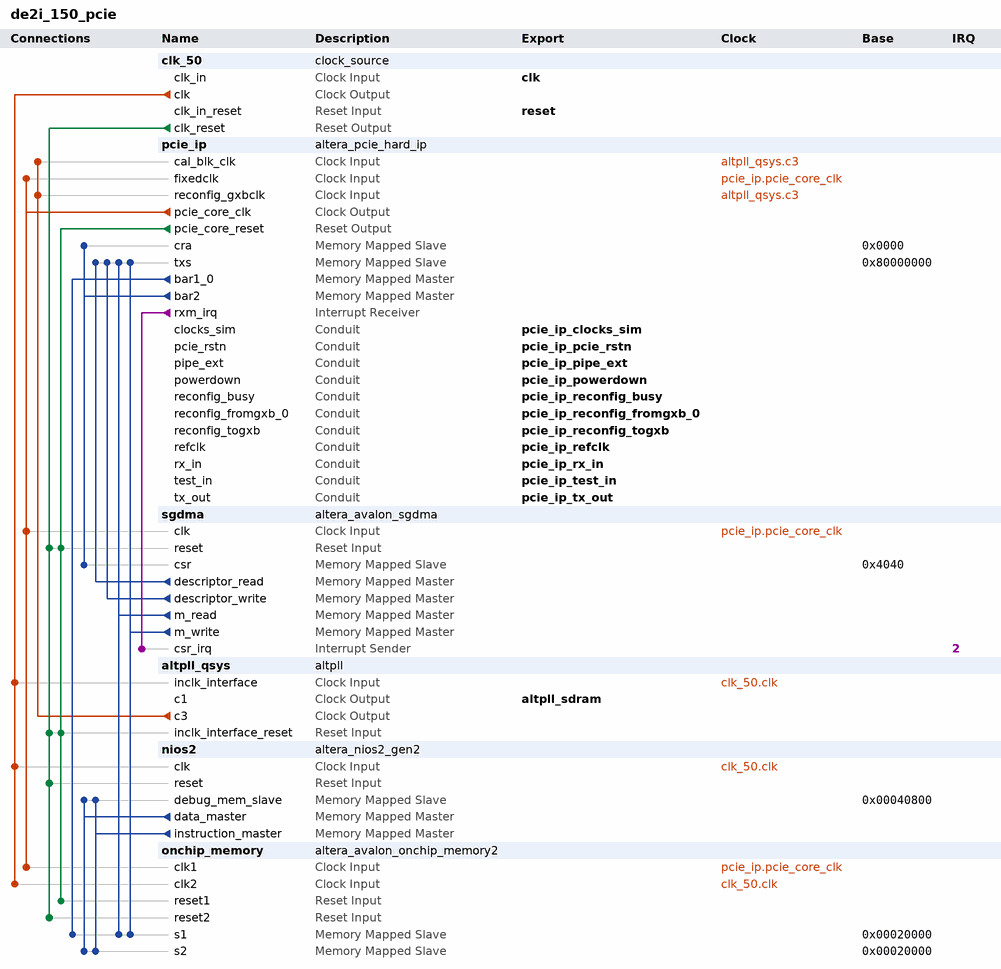
[diagram p0: system contents]
# Platform Designer (Qsys) system de2i_150_pcie, Cyclone IV GX EP4CGX150DF31C7
# Parameters at their usual value, and those the tool derives, are not listed.
package require -exact qsys 15.1
create_system de2i_150_pcie
set_project_property DEVICE_FAMILY {Cyclone IV GX}
set_project_property DEVICE EP4CGX150DF31C7

add_instance clk_50 clock_source 15.1
set_instance_parameter_value clk_50 clockFrequency 50000000

add_instance pcie_ip altera_pcie_hard_ip 15.1
set_instance_parameter_value pcie_ip {BAR Type} {64 bit Prefetchable,Not used,32 bit Non-Prefetchable,Not used,Not used,Not used}
set_instance_parameter_value pcie_ip CB_A2P_ADDR_MAP_PASS_THRU_BITS 31
set_instance_parameter_value pcie_ip CG_ENABLE_A2P_INTERRUPT 0
set_instance_parameter_value pcie_ip CG_NO_CPL_REORDERING 0
set_instance_parameter_value pcie_ip {PCIe Address 31:0} 0x00000000,0x00000000,0x00000000,0x00000000,0x00000000,0x00000000,0x00000000,0x00000000,0x00000000,0x00000000,0x00000000,0x00000000,0x00000000,0x00000000,0x00000000,0x00000000
set_instance_parameter_value pcie_ip {PCIe Address 63:32} 0x00000000,0x00000000,0x00000000,0x00000000,0x00000000,0x00000000,0x00000000,0x00000000,0x00000000,0x00000000,0x00000000,0x00000000,0x00000000,0x00000000,0x00000000,0x00000000
set_instance_parameter_value pcie_ip class_code 0
set_instance_parameter_value pcie_ip device_id 57345
set_instance_parameter_value pcie_ip my_advanced_errors false
set_instance_parameter_value pcie_ip my_enable_ecrc_check false
set_instance_parameter_value pcie_ip my_enable_ecrc_gen false
set_instance_parameter_value pcie_ip p_pcie_test_out_width None
set_instance_parameter_value pcie_ip p_user_msi_enable 0
set_instance_parameter_value pcie_ip subsystem_device_id 4
set_instance_parameter_value pcie_ip subsystem_vendor_id 4466
set_instance_parameter_value pcie_ip vendor_id 4466

add_instance sgdma altera_avalon_sgdma 15.1
set_instance_parameter_value sgdma enableBurstTransfers true
set_instance_parameter_value sgdma enableUnalignedTransfers false
set_instance_parameter_value sgdma readBlockDataWidth 64
set_instance_parameter_value sgdma sinkErrorWidth 0
set_instance_parameter_value sgdma sourceErrorWidth 0
set_instance_parameter_value sgdma transferMode MEMORY_TO_MEMORY
set_instance_parameter_value sgdma writeBurstcountWidth 8

add_instance altpll_qsys altpll 15.1
set_instance_parameter_value altpll_qsys CLK0_DIVIDE_BY 1
set_instance_parameter_value altpll_qsys CLK0_MULTIPLY_BY 3
set_instance_parameter_value altpll_qsys CLK1_DIVIDE_BY 1
set_instance_parameter_value altpll_qsys CLK1_DUTY_CYCLE 50
set_instance_parameter_value altpll_qsys CLK1_MULTIPLY_BY 3
set_instance_parameter_value altpll_qsys CLK1_PHASE_SHIFT -1852
set_instance_parameter_value altpll_qsys CLK2_DIVIDE_BY 1
set_instance_parameter_value altpll_qsys CLK2_DUTY_CYCLE 50
set_instance_parameter_value altpll_qsys CLK2_MULTIPLY_BY 1
set_instance_parameter_value altpll_qsys CLK2_PHASE_SHIFT 0
set_instance_parameter_value altpll_qsys CLK3_DIVIDE_BY 1
set_instance_parameter_value altpll_qsys CLK3_DUTY_CYCLE 50
set_instance_parameter_value altpll_qsys CLK3_MULTIPLY_BY 2
set_instance_parameter_value altpll_qsys CLK3_PHASE_SHIFT 0
set_instance_parameter_value altpll_qsys INCLK0_INPUT_FREQUENCY 20000
set_instance_parameter_value altpll_qsys PORT_ARESET PORT_USED
set_instance_parameter_value altpll_qsys PORT_LOCKED PORT_USED
set_instance_parameter_value altpll_qsys PORT_clk1 PORT_USED
set_instance_parameter_value altpll_qsys PORT_clk2 PORT_USED
set_instance_parameter_value altpll_qsys PORT_clk3 PORT_USED

add_instance nios2 altera_nios2_gen2 15.1
set_instance_parameter_value nios2 dcache_size 2048
set_instance_parameter_value nios2 exceptionSlave onchip_memory.s2
set_instance_parameter_value nios2 icache_size 4096
set_instance_parameter_value nios2 impl Tiny
set_instance_parameter_value nios2 resetSlave onchip_memory.s2

add_instance onchip_memory altera_avalon_onchip_memory2 15.1
set_instance_parameter_value onchip_memory dataWidth 64
set_instance_parameter_value onchip_memory dualPort true
set_instance_parameter_value onchip_memory initMemContent true
set_instance_parameter_value onchip_memory initializationFileName onchip_memory2_0
set_instance_parameter_value onchip_memory memorySize 131072
set_instance_parameter_value onchip_memory useNonDefaultInitFile true

# connections
add_connection altpll_qsys.c3 pcie_ip.cal_blk_clk clock
add_connection altpll_qsys.c3 pcie_ip.reconfig_gxbclk clock
add_connection clk_50.clk altpll_qsys.inclk_interface clock
add_connection clk_50.clk nios2.clk clock
add_connection clk_50.clk onchip_memory.clk2 clock
add_connection pcie_ip.pcie_core_clk onchip_memory.clk1 clock
add_connection pcie_ip.pcie_core_clk pcie_ip.fixedclk clock
add_connection pcie_ip.pcie_core_clk sgdma.clk clock
add_connection clk_50.clk_reset altpll_qsys.inclk_interface_reset reset
add_connection clk_50.clk_reset nios2.reset reset
add_connection clk_50.clk_reset onchip_memory.reset2 reset
add_connection clk_50.clk_reset sgdma.reset reset
add_connection pcie_ip.pcie_core_reset altpll_qsys.inclk_interface_reset reset
add_connection pcie_ip.pcie_core_reset onchip_memory.reset1 reset
add_connection pcie_ip.pcie_core_reset sgdma.reset reset
add_connection nios2.data_master nios2.debug_mem_slave avalon
set_connection_parameter_value nios2.data_master/nios2.debug_mem_slave baseAddress 0x00040800
add_connection nios2.data_master onchip_memory.s2 avalon
set_connection_parameter_value nios2.data_master/onchip_memory.s2 baseAddress 0x00020000
add_connection nios2.instruction_master nios2.debug_mem_slave avalon
set_connection_parameter_value nios2.instruction_master/nios2.debug_mem_slave baseAddress 0x00040800
add_connection nios2.instruction_master onchip_memory.s2 avalon
set_connection_parameter_value nios2.instruction_master/onchip_memory.s2 baseAddress 0x00020000
add_connection pcie_ip.bar1_0 onchip_memory.s1 avalon
set_connection_parameter_value pcie_ip.bar1_0/onchip_memory.s1 baseAddress 0x00020000
add_connection pcie_ip.bar2 pcie_ip.cra avalon
set_connection_parameter_value pcie_ip.bar2/pcie_ip.cra baseAddress 0x0000
add_connection pcie_ip.bar2 sgdma.csr avalon
set_connection_parameter_value pcie_ip.bar2/sgdma.csr baseAddress 0x4040
add_connection sgdma.descriptor_read pcie_ip.txs avalon
set_connection_parameter_value sgdma.descriptor_read/pcie_ip.txs baseAddress 0x80000000
add_connection sgdma.descriptor_write pcie_ip.txs avalon
set_connection_parameter_value sgdma.descriptor_write/pcie_ip.txs baseAddress 0x80000000
add_connection sgdma.m_read onchip_memory.s1 avalon
set_connection_parameter_value sgdma.m_read/onchip_memory.s1 baseAddress 0x00020000
add_connection sgdma.m_read pcie_ip.txs avalon
set_connection_parameter_value sgdma.m_read/pcie_ip.txs arbitrationPriority 2
set_connection_parameter_value sgdma.m_read/pcie_ip.txs baseAddress 0x80000000
add_connection sgdma.m_write onchip_memory.s1 avalon
set_connection_parameter_value sgdma.m_write/onchip_memory.s1 baseAddress 0x00020000
add_connection sgdma.m_write pcie_ip.txs avalon
set_connection_parameter_value sgdma.m_write/pcie_ip.txs arbitrationPriority 2
set_connection_parameter_value sgdma.m_write/pcie_ip.txs baseAddress 0x80000000
add_connection pcie_ip.rxm_irq sgdma.csr_irq interrupt
set_connection_parameter_value pcie_ip.rxm_irq/sgdma.csr_irq irqNumber 2

# exported interfaces
add_interface altpll_sdram clock source
set_interface_property altpll_sdram EXPORT_OF altpll_qsys.c1
add_interface clk clock sink
set_interface_property clk EXPORT_OF clk_50.clk_in
add_interface pcie_ip_clocks_sim conduit end
set_interface_property pcie_ip_clocks_sim EXPORT_OF pcie_ip.clocks_sim
add_interface pcie_ip_pcie_rstn conduit end
set_interface_property pcie_ip_pcie_rstn EXPORT_OF pcie_ip.pcie_rstn
add_interface pcie_ip_pipe_ext conduit end
set_interface_property pcie_ip_pipe_ext EXPORT_OF pcie_ip.pipe_ext
add_interface pcie_ip_powerdown conduit end
set_interface_property pcie_ip_powerdown EXPORT_OF pcie_ip.powerdown
add_interface pcie_ip_reconfig_busy conduit end
set_interface_property pcie_ip_reconfig_busy EXPORT_OF pcie_ip.reconfig_busy
add_interface pcie_ip_reconfig_fromgxb_0 conduit end
set_interface_property pcie_ip_reconfig_fromgxb_0 EXPORT_OF pcie_ip.reconfig_fromgxb_0
add_interface pcie_ip_reconfig_togxb conduit end
set_interface_property pcie_ip_reconfig_togxb EXPORT_OF pcie_ip.reconfig_togxb
add_interface pcie_ip_refclk conduit end
set_interface_property pcie_ip_refclk EXPORT_OF pcie_ip.refclk
add_interface pcie_ip_rx_in conduit end
set_interface_property pcie_ip_rx_in EXPORT_OF pcie_ip.rx_in
add_interface pcie_ip_test_in conduit end
set_interface_property pcie_ip_test_in EXPORT_OF pcie_ip.test_in
add_interface pcie_ip_tx_out conduit end
set_interface_property pcie_ip_tx_out EXPORT_OF pcie_ip.tx_out
add_interface reset reset sink
set_interface_property reset EXPORT_OF clk_50.clk_in_reset

set_interconnect_requirement {$system} qsys_mm.clockCrossingAdapter HANDSHAKE
set_interconnect_requirement {$system} qsys_mm.maxAdditionalLatency 1

save_system de2i_150_pcie.qsys
